# Altium schematic sheet completed.SchDoc
size A4
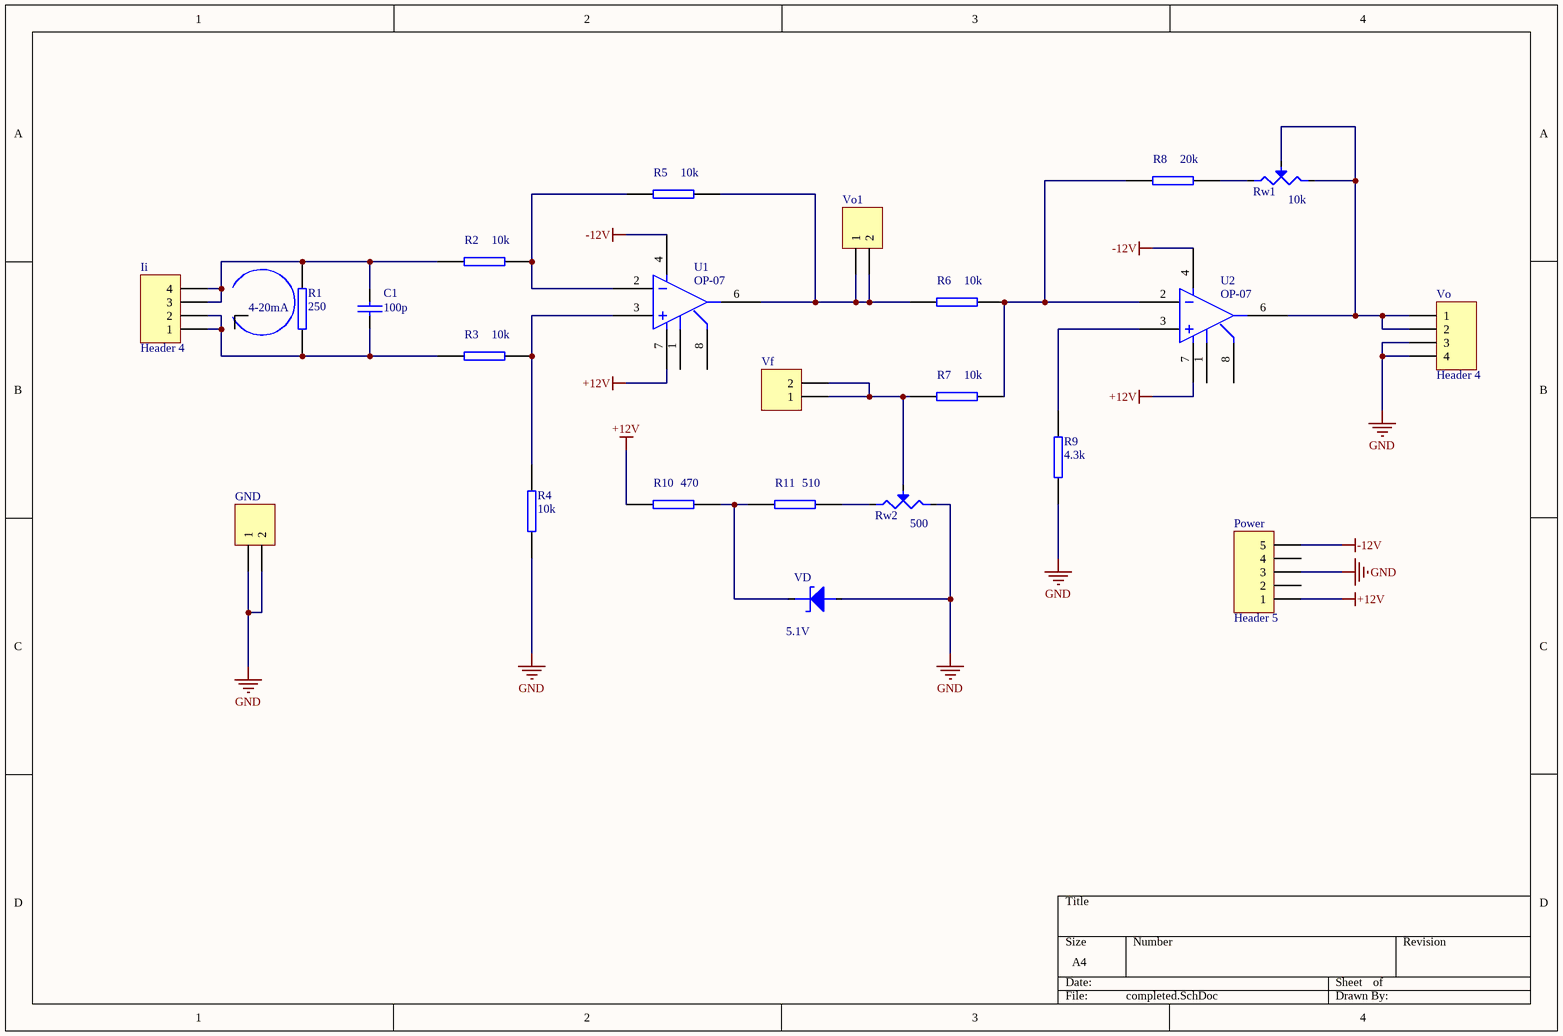
[diagram p0: completed.SchDoc]

## Parts
C1  CAP  [RAD-0.2]  (value not drawn)
GND  Header 2  [SIP-2]  (value not drawn)
Ii  Header 4  [SIP-4]
Power  Header 5  [POWER PLUG5]
R1  R1: 250  [AXIAL0.4]  (hidden comment: RES2)
R2  RES2  [AXIAL0.4]  (value not drawn)
R3  value 10k  [AXIAL0.4]  (hidden comment: RES2)
R4  R1: 10k  [AXIAL0.4]  (hidden comment: RES2)
R5  RES2  [AXIAL0.4]  (value not drawn)
R6  value 10k  [AXIAL0.4]  (hidden comment: RES2)
R7  RES2  [AXIAL0.4]  (value not drawn)
R8  value 20k  [AXIAL0.4]  (hidden comment: RES2)
R9  value 4.3k  [AXIAL0.4]  (hidden comment: RES2)
R10  value': 470  [AXIAL0.4]  (hidden comment: RES2)
R11  value 510  [AXIAL0.4]  (hidden comment: RES2)
Rw1  value 10k  [VR-5]  (hidden comment: POT1)
Rw2  value 500  [VR-5]  (hidden comment: POT1)
U1  OP-07  [DIP-8]
U2  OP-07  [DIP-8]
VD  value 5.1V  [DIODE-0.4]  (hidden comment: ZENER2)
Vf  Header 2  [SIP-2]  (value not drawn)
Vo  Header 4  [SIP-4]
Vo1  Header 2  [SIP-2]  (value not drawn)

## Nets
+12V: Power.1 R10.1 U1.7 U2.7
-12V: Power.5 U1.4 U2.4
GND: GND.1 GND.2 Power.3 R4.1 R9.1 Rw2.1 VD.1(A) Vo.3 Vo.4
NetC1_1: C1.1 Ii.3 Ii.4 R1.2 R2.1
NetC1_2: C1.2 Ii.1 Ii.2 R1.1 R3.1
NetR2_2: R2.2 R5.1 U1.2
NetR3_2: R3.2 R4.2 U1.3
NetR5_2: R5.2 R6.1 U1.6 Vo1.1 Vo1.2
NetR6_2: R6.2 R7.2 R8.1 U2.2
NetR7_1: R7.1 Rw2.3(W) Vf.1 Vf.2
NetR8_2: R8.2 Rw1.1
NetR9_2: R9.2 U2.3
NetR10_2: R10.2 R11.1 VD.2(K)
NetR11_2: R11.2 Rw2.2
NetRw1_2: Rw1.2 Rw1.3(W) U2.6 Vo.1 Vo.2

Not connected (* = marked no-connect by the designer): Power 2 4; U1 1 8; U2 1 8

## Notes on the sheet
- (near R1) 4-20mA
- (in symbol CAP) 100p
- (in symbol RES2) 10k

## Library data of the parts
GND Vf Vo1 = Header 2: Header, 2-Pin; LatestRevisionDate: 17-Jul-2002; LatestRevisionNote: Re-released for DXP Platform.; Publisher: Altium Limited
Ii Vo = Header 4: Header, 4-Pin; LatestRevisionDate: 17-Jul-2002; LatestRevisionNote: Re-released for DXP Platform.; Publisher: Altium Limited
Power = Header 5: Header, 5-Pin; LatestRevisionDate: 17-Jul-2002; LatestRevisionNote: Re-released for DXP Platform.; Publisher: Altium Limited
Rw1 Rw2 = POT1: Potentiometer
VD = ZENER2: Zener Diode